# EAGLE design T2313_DemoBoard (EAGLE 6.5.0)
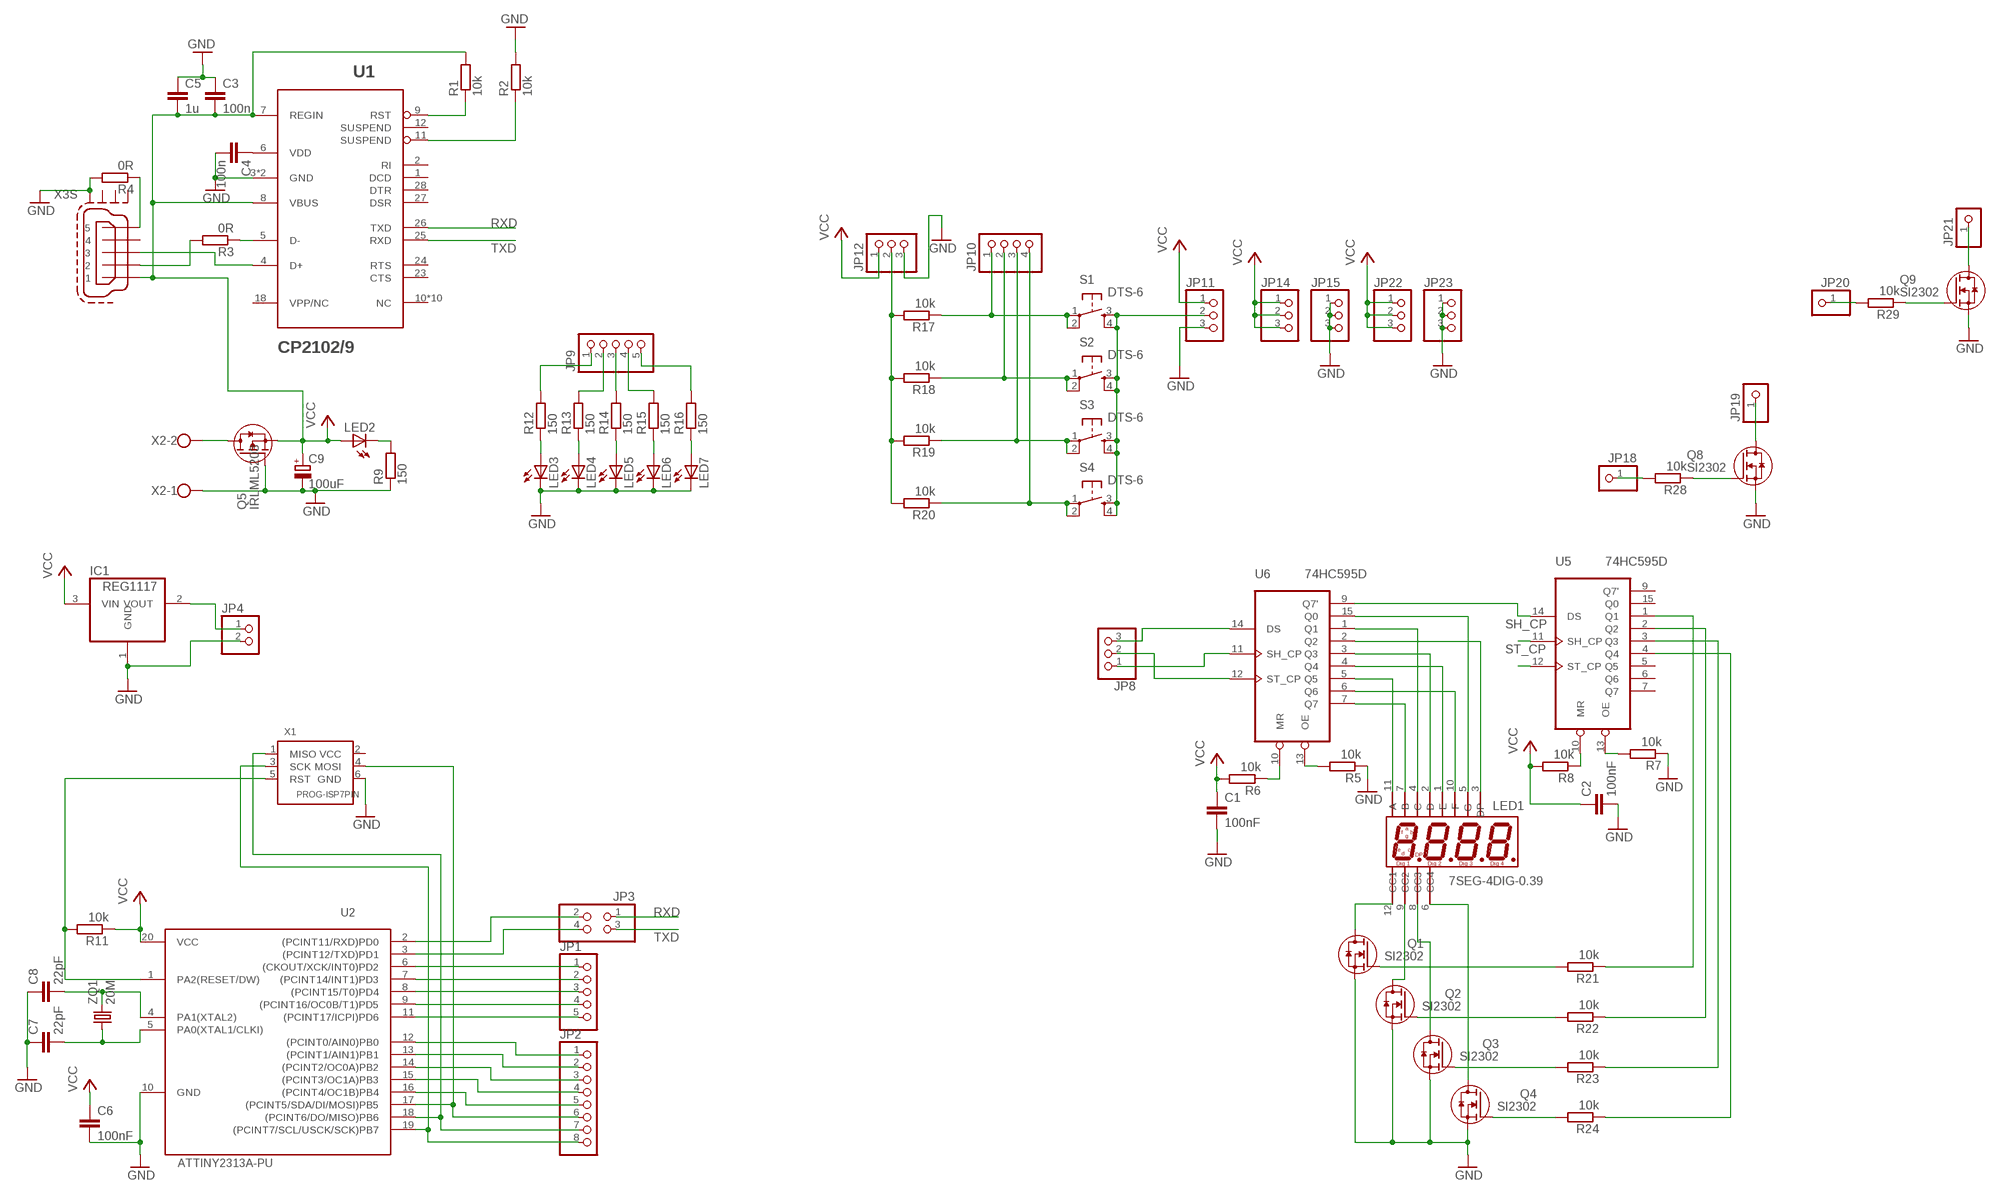
[diagram p0: schematic, sheet 1]

## Parts
C1  100nF  C-EUC0603  [C0603]
C2  100nF  C-EUC0603  [C0603]
C3  100n  C-EUC0603  [C0603]
C4  100n  C-EUC0603  [C0603]
C5  1u  C-EUC0805  [C0805]
C6  100nF  C-EUC0603  [C0603]
C7  22pF  C-EUC0603  [C0603]
C8  22pF  C-EUC0603  [C0603]
C9  100uF  CPOL-EUE2-5  [E2-5]
IC1  REG1117  [SOT223]
JP1  PINHD-1X5  [1X05]
JP2  PINHD-1X8  [1X08]
JP3  PINHD-2X2  [2X02]
JP4  PINHD-1X2  [1X02]
JP8  PINHD-1X3  [1X03]
JP9  PINHD-1X5  [1X05]
JP10  PINHD-1X4  [1X04]
JP11  PINHD-1X3  [1X03]
JP12  PINHD-1X3  [1X03]
JP14  PINHD-1X3  [1X03]
JP15  PINHD-1X3  [1X03]
JP18  PINHD-1X1  [1X01]
JP19  PINHD-1X1  [1X01]
JP20  PINHD-1X1  [1X01]
JP21  PINHD-1X1  [1X01]
JP22  PINHD-1X3  [1X03]
JP23  PINHD-1X3  [1X03]
LED1  7SEG-4DIG-0.39  [7SEG_4DIG_0.39]
LED2  LEDSML0805  [SML0805]
LED3  LEDCHIPLED_0805  [CHIPLED_0805]
LED4  LEDCHIPLED_0805  [CHIPLED_0805]
LED5  LEDCHIPLED_0805  [CHIPLED_0805]
LED6  LEDCHIPLED_0805  [CHIPLED_0805]
LED7  LEDCHIPLED_0805  [CHIPLED_0805]
Q1  SI2302  [SOT-23-GSD]
Q2  SI2302  [SOT-23-GSD]
Q3  SI2302  [SOT-23-GSD]
Q4  SI2302  [SOT-23-GSD]
Q5  IRLML5203  [SOT-23-GSD]
Q8  SI2302  [SOT-23-GSD]
Q9  SI2302  [SOT-23-GSD]
R1  10k  R-EU_R0603  [R0603]
R2  10k  R-EU_R0603  [R0603]
R3  0R  R-EU_R0805  [R0805]
R4  0R  R-EU_R0805  [R0805]
R5  10k  R-EU_R0805  [R0805]
R6  10k  R-EU_R0805  [R0805]
R7  10k  R-EU_R0805  [R0805]
R8  10k  R-EU_R0805  [R0805]
R9  150  R-EU_R0805  [R0805]
R11  10k  R-EU_R0805  [R0805]
R12  150  R-EU_R0805  [R0805]
R13  150  R-EU_R0805  [R0805]
R14  150  R-EU_R0805  [R0805]
R15  150  R-EU_R0805  [R0805]
R16  150  R-EU_R0805  [R0805]
R17  10k  R-EU_R0805  [R0805]
R18  10k  R-EU_R0805  [R0805]
R19  10k  R-EU_R0805  [R0805]
R20  10k  R-EU_R0805  [R0805]
R21  10k  R-EU_R0805  [R0805]
R22  10k  R-EU_R0805  [R0805]
R23  10k  R-EU_R0805  [R0805]
R24  10k  R-EU_R0805  [R0805]
R28  10k  R-EU_R0805  [R0805]
R29  10k  R-EU_R0805  [R0805]
S1  DTS-6  [DTS-6]
S2  DTS-6  [DTS-6]
S3  DTS-6  [DTS-6]
S4  DTS-6  [DTS-6]
U1  CP2102/9  [QFN-28]
U2  ATTINY2313A-PU  [DIL20]
U5  74HC595D  [SO16]
U6  74HC595D  [SO16]
X1  PROG-ISP7PIN  [PROG_PIN]
X2  W237-102  [W237-102]
X3  MINI-USB-SCHIELD-32005-201  [32005-201]
ZQ1  20M  CRYSTALHC49S  [HC49/S]

## Nets
GND: C1.2 C2.2 C3.1 C4.2 C5.1 C6.2 C7.1 C8.1 C9.- IC1.1(GND) JP4.2 JP11.3 JP12.3 JP15.1 JP15.2 JP15.3 JP23.1 JP23.2 JP23.3 LED3.C LED4.C LED5.C LED6.C LED7.C Q1.S Q2.S Q3.S Q4.S Q5.G Q8.S Q9.S R2.2 R4.2 R5.1 R7.1 R9.1 U1.3(GND) U1.P$29(GND) U2.10(GND) X1.6(GND) X2.1 X3.M4(S:S4)
N$1: JP1.5 U2.11((PCINT17/ICPI)PD6)
N$3: JP1.4 U2.9((PCINT16/OC0B/T1)PD5)
N$4: JP1.3 U2.8((PCINT15/T0)PD4)
N$5: JP1.2 U2.7((PCINT14/INT1)PD3)
N$6: JP1.1 U2.6((CKOUT/XCK/INT0)PD2)
N$7: JP3.4 U2.3((PCINT12/TXD)PD1)
N$8: JP3.2 U2.2((PCINT11/RXD)PD0)
N$9: R6.1 U6.10(MR)
N$10: JP2.7 U2.18((PCINT6/DO/MISO)PB6) X1.1(MISO)
N$11: C4.1 U1.6(VDD)
N$12: JP2.5 U2.16((PCINT4/OC1B)PB4)
N$13: JP2.4 U2.15((PCINT3/OC1A)PB3)
N$14: JP2.3 U2.14((PCINT2/OC0A)PB2)
N$15: JP2.2 U2.13((PCINT1/AIN1)PB1)
N$16: JP2.1 U2.12((PCINT0/AIN0)PB0)
N$17: R1.1 U1.9(RST)
N$18: R3.2 X3.2
N$19: U1.4(D+) X3.3
N$20: R5.2 U6.13(OE)
N$21: R2.1 U1.11(SUSPEND)
N$22: R8.1 U5.10(MR)
N$23: R3.1 U1.5(D-)
N$24: IC1.2(VOUT) JP4.1
N$25: R7.2 U5.13(OE)
N$26: R4.1 X3.5
N$27: JP8.3 U6.14(DS)
N$28: LED1.11(A) U6.5(Q5)
N$29: LED1.7(B) U6.7(Q7)
N$30: U5.14(DS) U6.9(Q7')
N$31: LED1.4(C) U6.1(Q1)
N$32: LED1.2(D) U6.3(Q3)
N$33: LED1.1(E) U6.4(Q4)
N$34: LED1.10(F) U6.6(Q6)
N$35: LED1.5(G) U6.15(Q0)
N$36: LED1.3(DP) U6.2(Q2)
N$37: LED1.12(CC1) Q1.D
N$38: LED1.9(CC2) Q2.D
N$39: LED1.8(CC3) Q3.D
N$40: LED1.6(CC4) Q4.D
N$41: R21.1 U5.1(Q1)
N$42: R22.1 U5.2(Q2)
N$43: R23.1 U5.3(Q3)
N$44: R24.1 U5.4(Q4)
N$45: C7.2 U2.5(PA0(XTAL1/CLKI)) ZQ1.1
N$46: C8.2 U2.4(PA1(XTAL2)) ZQ1.2
N$47: R11.2 U2.1(PA2(RESET/DW)) X1.5(RST)
N$48: LED2.C R9.2
N$49: LED3.A R12.1
N$50: LED4.A R13.1
N$51: LED5.A R14.1
N$52: LED6.A R15.1
N$53: LED7.A R16.1
N$54: JP9.1 R12.2
N$55: JP9.3 R14.2
N$56: JP9.4 R15.2
N$57: JP9.2 R13.2
N$58: JP9.5 R16.2
N$59: JP10.2 R18.1 S2.1 S2.2
N$60: JP12.2 R17.2 R18.2 R19.2 R20.2
N$61: JP10.1 R17.1 S1.1 S1.2
N$62: JP11.2 S1.3 S1.4 S2.3 S2.4 S3.3 S3.4 S4.3 S4.4
N$63: JP10.3 R19.1 S3.1 S3.2
N$64: JP10.4 R20.1 S4.1 S4.2
N$65: Q4.G R24.2
N$66: Q3.G R23.2
N$67: Q2.G R22.2
N$68: Q1.G R21.2
N$69: Q5.D X2.2
N$72: JP19.1 Q8.D
N$74: Q8.G R28.1
N$75: JP18.1 R28.2
N$76: JP21.1 Q9.D
N$80: Q9.G R29.1
N$81: JP20.1 R29.2
RXD: JP3.1 U1.26(TXD)
SCL: JP2.8 U2.19((PCINT7/SCL/USCK/SCK)PB7) X1.3(SCK)
SDA: JP2.6 U2.17((PCINT5/SDA/DI/MOSI)PB5) X1.4(MOSI)
SH_CP: JP8.1 U5.11(SH_CP) U6.11(SH_CP)
ST_CP: JP8.2 U5.12(ST_CP) U6.12(ST_CP)
TXD: JP3.3 U1.25(RXD)
VCC: C1.1 C2.1 C3.2 C5.2 C6.1 C9.+ IC1.3(VIN) JP11.1 JP12.1 JP14.1 JP14.2 JP14.3 JP22.1 JP22.2 JP22.3 LED2.A Q5.S R1.2 R6.2 R8.2 R11.1 U1.7(REGIN) U1.8(VBUS) U2.20(VCC) X3.1
Unconnected: U1.1(DCD) U1.2(RI) U1.10(NC) U1.12(SUSPEND) U1.13(NC) U1.14(NC) U1.15(NC) U1.16(NC) U1.17(NC) U1.18(VPP/NC) U1.19(NC) U1.20(NC) U1.21(NC) U1.22(NC) U1.23(CTS) U1.24(RTS) U1.27(DSR) U1.28(DTR) U5.5(Q5) U5.6(Q6) U5.7(Q7) U5.9(Q7') U5.15(Q0) X1.2(VCC) X3.4 X3.M1(S:S1) X3.M2(S:S2) X3.M3(S:S3)

## Power pins joined to a net without a drawn wire
GND: U5.8(GND) U6.8(GND)
VCC: U5.16(VCC) U6.16(VCC)

## Library data of the parts
C1-C8 = rcl:C-EU: CAPACITOR, European symbol
C9 = rcl:CPOL-EU: POLARIZED CAPACITOR, European symbol
IC1 = burr-brown:REG1117: 800mA and 1A Low Dropout (LDO) Positive Regulator 1.8V, 2.5V, 2.85V, 3.3V, 5V, and Adj; MPN: REG1117; OC_FARNELL: 1097566; OC_NEWARK: 14P6981
JP1 JP9 = pinhead:PINHD-1X5: PIN HEADER
JP2 = pinhead:PINHD-1X8: PIN HEADER
JP3 = usb:PINHD-2X2: PIN HEADER
JP4 = pinhead:PINHD-1X2: PIN HEADER
JP8 JP11 JP12 JP14 JP15 JP22 JP23 = pinhead:PINHD-1X3: PIN HEADER
JP10 = pinhead:PINHD-1X4: PIN HEADER
JP18-JP21 = pinhead:PINHD-1X1: PIN HEADER
LED1 = usb:7SEG-4DIG: 7 Segment 4 Digit Common Catode
LED2-LED7 = led:LED: LED OSRAM: - CHIPLED LG R971, LG N971, LY N971, LG Q971, LY Q971, LO R971, LY R971 LH N974, LH R974 LS Q976, LO Q976, LY Q976 LO Q996 - Hyper CHIPLED LW Q18S LB Q993, LB Q99A, LB R99A - SideLED LS A670, LO A670, LY A670, LG A670, LP A670 LB A673, LV A673, LT A673, LW A673 LH A674 LY A675 LS A676, LA A676, LO A676, LY A676, LW A676 LS A679, LY A679, LG A679 - Hyper Micro SIDELED® LS Y876, LA Y876, LO Y876, LY Y876 LT Y87S - SmartLED LW L88C, LW L88S LB L89C, LB L89S, LG L890 LS L89K, LO L89K, LY L89K LS L896, LA L896, LO L896, LY L896 - TOPLED LS T670, LO T670, LY T670, LG T670, LP T670 LSG T670, LSP T670, LSY T670, LOP T670, LYG T670 LG T671, LOG T671, LSG T671 LB T673, LV T673, LT T673, LW T673 LH T674 LS T676, LA T676, LO T676, LY T676, LB T676, LH T676, LSB T676, LW T676 LB T67C, LV T67C, LT T67C, LS T67K, LO T67K, LY T67K, LW E67C LS E67B, LA E67B, LO E67B, LY E67B, LB E67C, LV E67C, LT E67C LW T67C LS T679, LY T679, LG T679 LS T770, LO T770, LY T770, LG T770, LP T770 LB T773, LV T773, LT T773, LW T773 LH T774 LS E675, LA E675, LY E675, LS T675 LS T776, LA T776, LO T776, LY T776, LB T776 LHGB T686 LT T68C, LB T68C - Hyper Mini TOPLED® LB M676 - Mini TOPLED Santana® LG M470 LS M47K, LO M47K, LY M47K Source: http://www.osram.convergy.de LUXEON: - LUMILED® LXK2-PW12-R00, LXK2-PW12-S00, LXK2-PW14-U00, LXK2-PW14-V00 LXK2-PM12-R00, LXK2-PM12-S00, LXK2-PM14-U00 LXK2-PE12-Q00, LXK2-PE12-R00, LXK2-PE12-S00, LXK2-PE14-T00, LXK2-PE14-U00 LXK2-PB12-K00, LXK2-PB12-L00, LXK2-PB12-M00, LXK2-PB14-N00, LXK2-PB14-P00, LXK2-PB14-Q00 LXK2-PR12-L00, LXK2-PR12-M00, LXK2-PR14-Q00, LXK2-PR14-R00 LXK2-PD12-Q00, LXK2-PD12-R00, LXK2-PD12-S00 LXK2-PH12-R00, LXK2-PH12-S00 LXK2-PL12-P00, LXK2-PL12-Q00, LXK2-PL12-R00 Source: www.luxeon.com KINGBRIGHT: KA-3528ASYC Source: www.kingbright.com
Q1-Q4 Q8 Q9 = usb:SI2302: N-канальный полевик
Q5 = usb:IRLML5203
R1-R9 R11-R24 R28 R29 = rcl:R-EU_: RESISTOR, European symbol
S1-S4 = switch-tact:DTS-6
U1 = usb:CP2102/9
U2 = usb:ATTINY2313A
U5 U6 = 74xx-eu:74*595: 8-bit SHIFT REGISTER, output latch
X1 = usb:PROG-ISP
X2 = con-wago-500:W237-102: WAGO SCREW CLAMP; MPN: 237-102; OC_FARNELL: unknown; OC_NEWARK: 70K9898
X3 = con-cypressindustries:MINI-USB-SCHIELD-: MINI USB-B Conector Source: www.cypressindustries.com; OC_FARNELL: unknown; OC_NEWARK: unknown
ZQ1 = crystal:CRYSTAL: CRYSTAL; OC_FARNELL: 1667008; OC_NEWARK: unknown

## Board
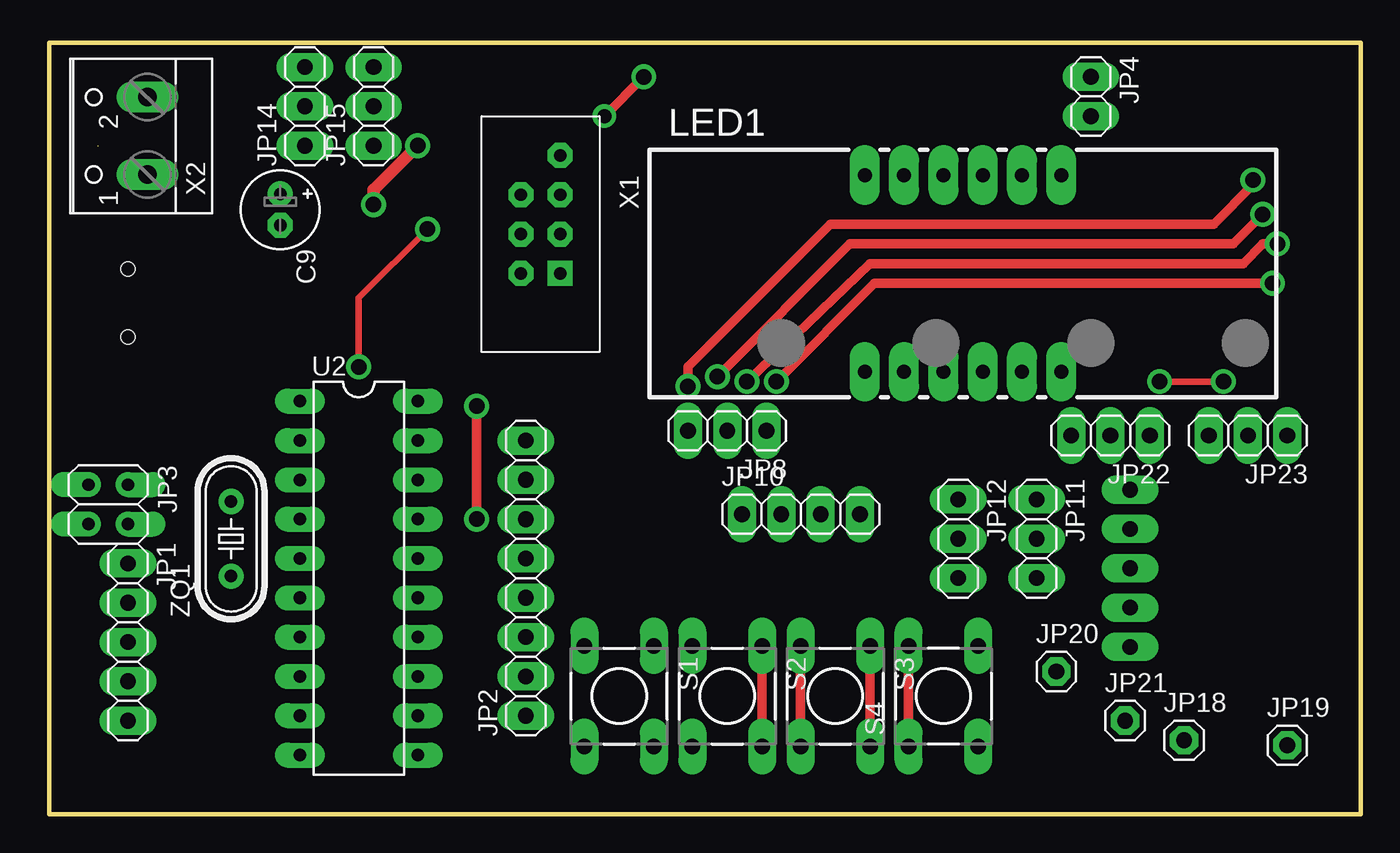
[diagram p1: board, top side]
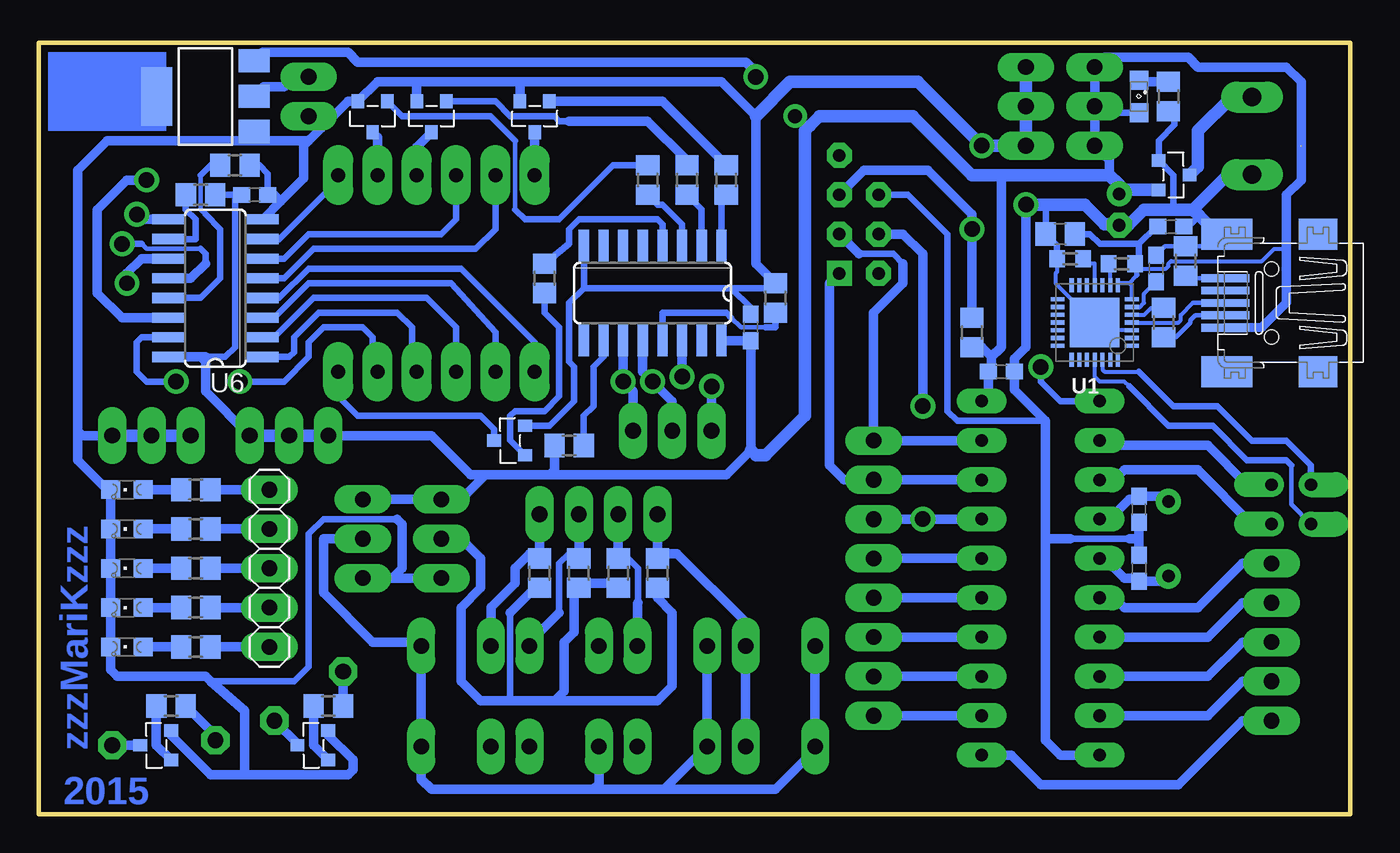
[diagram p2: board, bottom side, seen from below]

Size 84.76 x 49.84 mm. Coordinates in mm from the lower left corner, seen from the top.
Outline: 0,0 84.76,0 84.76,49.84 0,49.84 0,0
Copper layers (1*16): Top 0.035mm / dielectric 1.5mm / Bottom 0.035mm
Design rules "default": minimum track width 12mil, minimum drill 32mil, track to track 12mil, track to pad 12mil, pad to pad 12mil, via to via 12mil, smd to smd 8mil, copper to edge 40mil, drill to drill 8mil, minimum pad ring 16mil, minimum via ring 12mil, stop-mask expansion 4mil, vias tented up to drill 0mil, thermal gap 20mil

### Footprints (pad centres in the part's own frame; a part is rotated, then mirrored left to right if it is on the bottom)
C0603 = smd 1.1 x 1: 1 -0.85,0; 2 0.85,0
C0805 = smd 1.3 x 1.5: 1 -0.95,0; 2 0.95,0
E2-5 = drill 0.813 pad 1.27: + -1.016,0 | drill 0.813 pad 1.27 octagon: - 1.016,0
SOT223 = smd 1.499 x 2.007: 1 -2.261,-3.15; 2 0.025,-3.15; 3 2.311,-3.15 | smd 3.81 x 2.007: 4 0,3.15
1X05 = drill 1.016 long: 1 -5.08,0; 2 -2.54,0; 3 0,0; 4 2.54,0; 5 5.08,0
1X08 = drill 1.016 long: 1 -8.89,0; 2 -6.35,0; 3 -3.81,0; 4 -1.27,0; 5 1.27,0; 6 3.81,0; 7 6.35,0; 8 8.89,0
2X02 = drill 0.8 offset: 1 -1.27,-1.27; 2 -1.27,1.27; 3 1.27,-1.27; 4 1.27,1.27
1X02 = drill 1.016 long: 1 -1.27,0; 2 1.27,0
1X03 = drill 1.016 long: 1 -2.54,0; 2 0,0; 3 2.54,0
1X04 = drill 1.016 long: 1 -3.81,0; 2 -1.27,0; 3 1.27,0; 4 3.81,0
1X01 = drill 1.016 octagon: 1 0,0
7SEG_4DIG_0.39 = drill 0.9 pad 1.93 long: 1 0,0; 2 2.54,0; 3 5.08,0; 4 7.62,0; 5 10.16,0; 6 12.7,0; 7 12.7,12.7; 8 10.16,12.7; 9 7.62,12.7; 10 5.08,12.7; 11 2.54,12.7; 12 0,12.7
SML0805 = smd 1.2 x 1.2: A 1.05,0; C -1.05,0
CHIPLED_0805 = smd 1.2 x 1.2: A 0,-1.05; C 0,1.05
SOT-23-GSD = smd 0.8 x 0.9: D 0,2; G -0.95,0; S 0.95,0
R0603 = smd 1 x 1.1: 1 -0.85,0; 2 0.85,0
R0805 = smd 1.3 x 1.5: 1 -0.95,0; 2 0.95,0
DTS-6 = drill 1 long: 1 -3.25,2.25; 2 3.25,2.25; 3 -3.25,-2.25; 4 3.25,-2.25
QFN-28 = smd 0.9 x 0.27: 1 -2.4,1.5; 2 -2.4,1; 3 -2.4,0.5; 4 -2.4,0; 5 -2.4,-0.5; 6 -2.4,-1; 7 -2.4,-1.5; 15 2.4,-1.5; 16 2.4,-1; 17 2.4,-0.5; 18 2.4,0; 19 2.4,0.5; 20 2.4,1; 21 2.4,1.5 | smd 0.27 x 0.9: 8 -1.5,-2.4; 9 -1,-2.4; 10 -0.5,-2.4; 11 0,-2.4; 12 0.5,-2.4; 13 1,-2.4; 14 1.5,-2.4; 22 1.5,2.4; 23 1,2.4; 24 0.5,2.4; 25 0,2.4; 26 -0.5,2.4; 27 -1,2.4; 28 -1.5,2.4 | smd 3.2 x 3.2: P$29 0,0
DIL20 = drill 0.813 long: 1 -11.43,-3.81; 2 -8.89,-3.81; 3 -6.35,-3.81; 4 -3.81,-3.81; 5 -1.27,-3.81; 6 1.27,-3.81; 7 3.81,-3.81; 8 6.35,-3.81; 9 8.89,-3.81; 10 11.43,-3.81; 11 11.43,3.81; 12 8.89,3.81; 13 6.35,3.81; 14 3.81,3.81; 15 1.27,3.81; 16 -1.27,3.81; 17 -3.81,3.81; 18 -6.35,3.81; 19 -8.89,3.81; 20 -11.43,3.81
SO16 = smd 0.66 x 2.032: 1 -4.445,-3.073; 2 -3.175,-3.073; 3 -1.905,-3.073; 4 -0.635,-3.073; 5 0.635,-3.073; 6 1.905,-3.073; 7 3.175,-3.073; 8 4.445,-3.073; 9 4.445,3.073; 10 3.175,3.073; 11 1.905,3.073; 12 0.635,3.073; 13 -0.635,3.073; 14 -1.905,3.073; 15 -3.175,3.073; 16 -4.445,3.073
PROG_PIN = drill 0.8 square: 1 0,7.62 | drill 0.8 octagon: 2 2.54,7.62; 3 0,5.08; 4 2.54,5.08; 5 0,2.54; 6 2.54,2.54; KEY 0,0
W237-102 = drill 1.194 long: 1 -2.5,-1.27; 2 2.5,-1.27
32005-201 = smd 3.1 x 0.5: 1 3,1.6; 2 3,0.8; 3 3,0; 4 3,-0.8; 5 3,-1.6 | smd 2.5 x 2: M1 -3,-4.45; M2 -3,4.45 | smd 3.3 x 2: M3 2.9,4.45; M4 2.9,-4.45 | hole 0.9: 0,2.2; 0,-2.2
HC49/S = drill 0.813: 1 -2.413,0; 2 2.413,0

### Placement (x,y rotation side)
C1  38.73,31.43 90 bottom
C2  70.8,40.01 0 bottom
C3  11.59,37.94 180 bottom
C4  12.54,35.24 90 bottom
C5  18.73,37.47 0 bottom
C6  22.54,28.57 0 bottom
C7  13.65,15.88 270 bottom
C8  13.65,19.68 90 bottom
C9  14.92,39.05 270 top
IC1  73.98,46.35 90 bottom
JP1  5.08,11.11 270 top
JP2  30.8,15.24 90 top
JP3  3.81,20 270 top
JP4  67.31,46.35 270 top
JP8  43.81,24.77 180 top
JP9  69.85,15.88 90 bottom
JP10  48.58,19.37 0 top
JP11  63.82,17.78 270 top
JP12  58.74,17.78 270 top
JP14  16.51,45.72 90 top
JP15  20.95,45.72 90 top
JP18  73.34,4.76 0 top
JP19  80.01,4.45 0 top
JP20  65.09,9.21 0 top
JP21  69.53,6.03 0 top
JP22  68.58,24.45 180 top
JP23  77.47,24.45 180 top
LED1  52.7,28.57 0 top
LED2  13.65,46.35 270 bottom
LED3  79.06,10.79 90 bottom
LED4  79.06,13.34 90 bottom
LED5  79.06,15.88 90 bottom
LED6  79.06,18.41 90 bottom
LED7  79.06,20.95 90 bottom
Q1  52.7,46.04 180 bottom
Q2  59.37,46.04 180 bottom
Q3  63.18,46.04 180 bottom
Q4  53.34,24.13 90 bottom
Q5  12.38,41.27 270 bottom
Q8  76.2,4.45 90 bottom
Q9  66.04,4.45 90 bottom
R1  14.76,35.56 0 bottom
R2  18.1,35.88 180 bottom
R3  12.06,31.75 270 bottom
R4  10.64,35.72 90 bottom
R5  72.07,41.91 180 bottom
R6  74.3,40.01 0 bottom
R7  37.15,33.34 270 bottom
R8  50.48,23.81 180 bottom
R9  11.75,46.35 90 bottom
R11  24.45,31.11 90 bottom
R12  74.61,10.79 0 bottom
R13  74.61,13.34 0 bottom
R14  74.61,15.88 0 bottom
R15  74.61,18.41 0 bottom
R16  74.61,20.95 0 bottom
R17  44.77,15.56 270 bottom
R18  47.31,15.56 270 bottom
R19  49.85,15.56 270 bottom
R20  52.39,15.56 270 bottom
R21  40.32,40.96 90 bottom
R22  42.86,40.96 90 bottom
R23  45.4,40.96 90 bottom
R24  52.07,34.61 270 bottom
R28  76.2,6.99 0 bottom
R29  66.04,6.99 0 bottom
S1  36.83,7.62 270 top
S2  43.81,7.62 270 top
S3  50.8,7.62 270 top
S4  57.78,7.62 90 top
U1  16.51,31.75 180 bottom
U2  20,15.24 270 top
U5  45.09,33.66 180 bottom
U6  73.34,33.97 90 bottom
X1  33.02,42.55 180 top
X2  5.08,43.81 90 top
X3  5.08,33.02 180 bottom
ZQ1  11.75,17.78 90 top

### Tracks (layer width: path | path; a pad name or v marks a point on that pad's centre or on a via)
GND  (via drill 1)
  Top 0.813: v20.95,39.37 20.95,40.32 v23.81,43.18
  Bottom 0.254: U1.3 16.01,31.25 U1.P$29 19.05,34.29 19.05,34.92 18.95,35.03 R2.2
  Bottom 0.305: C4.2 11.96,36.67 R4.2 9.53,36.67 8.73,37.47
  Bottom 0.406: 14.29,17.78 18.1,17.78 | U5.8 49.53,33.97 | 49.53,33.97 50.48,33.02 50.48,29.21 50.16,28.89 50.16,26.67 51.75,25.08 Q4.S | C1.2 38.73,32.7 40.01,33.97 | 40.01,33.97 49.53,33.97 | R5.1 70.48,41.91 69.95,41.38 C2.2 | R7.1 36.83,33.97 40.01,33.97 | X1.6 28.57,40.01 26.04,37.47 26.04,26.04 25.4,25.4 19.68,25.4 | 61.59,19.05 66.36,19.05 67.31,18.1 67.31,9.53 68.26,8.57 73.66,8.57 | 11.36,45.41 11.36,44.52 12.38,43.5 Q5.G 11.43,41.27 11.43,39.37 11.11,39.05 | C3.1 10.48,37.94 9.76,38.66 | R2.2 18.95,36.73 C5.1 19.68,39.21 19.53,39.37
  Bottom 0.61: C8.1 13.65,17.78 | 13.65,17.78 14.29,17.78 | 19.68,17.78 19.68,25.4 21.69,27.41 C6.2 21.69,29.43 20.95,30.16 v20.95,39.37 | 19.68,17.78 19.68,4.76 18.73,3.81 U2.10 | R7.1 38.42,35.56 38.42,45.09 40.64,47.31 53.66,47.31 | Q1.S 53.66,47.31 | 60.33,47.31 62.86,47.31 Q3.S 64.77,46.04 66.52,44.29 | 60.33,47.31 53.66,47.31 | Q2.S 60.33,47.31 | C7.1 13.65,17.78 | JP12.3 JP11.3 61.91,15.24 61.28,15.88 61.28,18.73 61.59,19.05 | Q9.S 66.04,5.08 64.45,3.49 64.45,2.86 64.77,2.54 71.44,2.54 | Q8.S 76.2,5.08 73.66,2.54 71.44,2.54 | 66.52,44.29 67.31,43.5 | 67.31,43.5 67.63,43.18 67.63,41.06 69.11,39.58 | 69.11,39.58 U6.8 | C2.2 69.64,40.11 69.11,39.58 | 82.23,24.77 82.23,41.59 80.33,43.5 70.48,43.5 | JP23.1 81.92,24.45 82.23,24.77 | 71.44,2.54 71.44,6.67 73.66,8.57 73.98,8.89 79.69,8.89 80.11,9.3 LED3.C LED4.C LED5.C LED6.C LED7.C 80.33,20.95 82.23,22.86 82.23,24.77 | R9.1 11.36,45.41 | 18.1,17.78 19.68,17.78 | X3.M4 8.73,37.47 9.21,37.47 | 70.48,43.5 67.31,43.5 | 67.31,43.5 67.33,43.52 | IC1.1 70.48,43.75 70.48,43.5 | JP4.2 66.52,44.29
  Bottom 0.813: JP23.1 JP23.2 JP23.3 | 38.42,45.09 36.2,47.31 27.94,47.31 v23.81,43.18 JP15.1 JP15.2 JP15.3 | R9.1 | X2.1 7.9,41.31 10.16,39.05 | v20.95,39.37 19.53,39.37 17.14,39.37 15.88,38.1 14.99,38.1 C9.- 14.35,38.04 13.34,39.05 11.11,39.05 10.16,39.05 | 9.21,37.47 9.21,38.1 9.76,38.66 10.16,39.05
N$1
  Bottom 0.61: U2.11 21.91,3.81 20,1.91 11.11,1.91 6.99,6.03 JP1.5
N$3
  Bottom 0.61: U2.9 9.21,6.35 6.99,8.57 JP1.4
N$4
  Bottom 0.61: U2.8 9.21,8.89 6.99,11.11 JP1.3
N$5
  Bottom 0.61: U2.7 9.21,11.43 6.99,13.65 JP1.2
N$6
  Bottom 0.61: U2.6 15.24,13.97 14.61,13.34 9.84,13.34 6.99,16.19 JP1.1
N$7
  Bottom 0.61: U2.3 15.24,21.59 14.61,22.23 9.84,22.23 6.35,18.73 JP3.4
N$8
  Bottom 0.61: U2.2 15.24,24.13 14.92,23.81 9.21,23.81 6.67,21.27 JP3.2
N$9
  Bottom 0.406: R6.1 75.25,39.05 74.61,38.42 74.61,37.15 U6.10
N$10
  Bottom 0.61: U2.18 JP2.7 32.7,21.59 33.66,22.54 33.66,34.29 X1.1
N$11
  Bottom 0.254: U1.6 13.61,32.75 13.34,33.02 13.34,33.6 C4.1
N$12
  Bottom 0.61: U2.16 JP2.5
N$13
  Bottom 0.61: U2.15 JP2.4
N$14
  Bottom 0.61: U2.14 JP2.3
N$15
  Bottom 0.61: U2.13 JP2.2
N$16
  Bottom 0.61: U2.12 JP2.1
N$17
  Bottom 0.254: U1.9 15.51,35.82 R1.1
N$18
  Bottom 0.305: X3.2 10.01,32.22 10.32,31.91 10.32,31.75 11.27,30.8 R3.2
N$19
  Bottom 0.254: U1.4 11.11,31.75 10.95,31.91 10.95,32.23 10.16,33.02
  Bottom 0.305: X3.3 10.16,33.02
N$20
  Bottom 0.305: 74.3,41.27 74.3,39.05 73.98,38.73
  Bottom 0.406: R5.2 73.66,41.91 74.3,41.27 | 73.98,38.73 73.03,37.78 73.03,34.61 74.3,33.34 U6.13
N$21
  Bottom 0.254: U1.11 16.51,35.56 16.93,35.56 R2.1
N$22
  Bottom 0.406: R8.1 49.53,25.71 48.9,26.35 48.9,28.89 48.26,29.53 U5.10
N$23
  Bottom 0.254: U1.5 13.31,32.25 12.86,32.7 R3.1
N$24
  Bottom 0.61: IC1.2 70.22,46.99 68.9,46.99 68.26,47.62 JP4.1
N$25
  Bottom 0.305: 37.78,31.43 39.37,31.43 40.01,32.07
  Bottom 0.406: R7.2 37.15,31.43 37.78,31.43 | 40.01,32.07 40.32,32.38 44.45,32.38 U5.13
N$26
  Bottom 0.305: X3.5 10.49,34.62 R4.1
N$27  (via drill 1)
  Top 0.61: v77.79,40.96 77.79,40.64 75.25,38.1 50.48,38.1 41.27,28.89 v41.27,27.62
  Bottom 0.61: U6.14 79.38,32.07 80.96,33.66 80.96,39.05 79.06,40.96 v77.79,40.96 | v41.27,27.62 JP8.3
N$28
  Bottom 0.406: U6.5 68.9,34.61 66.99,36.51 56.52,36.51 55.24,37.78 LED1.11
N$29
  Bottom 0.406: U6.7 69.22,37.15 65.41,40.96 LED1.7
N$30  (via drill 1)
  Top 0.61: v78.42,38.73 76.52,36.83 51.75,36.83 v43.18,28.26
  Bottom 0.61: U6.9 78.11,38.42 v78.42,38.73 | v43.18,28.26 U5.14
N$31
  Bottom 0.406: U6.1 68.58,29.53 68.26,29.84 68.26,30.8 66.67,32.38 61.59,32.38 60.64,31.43 60.64,28.89 LED1.4
N$32
  Bottom 0.406: U6.3 69.53,32.07 67.31,34.29 58.1,34.29 55.24,31.11 LED1.2
N$33
  Bottom 0.406: U6.4 69.22,33.34 67.31,35.24 57.47,35.24 52.7,30.48 LED1.1
N$34
  Bottom 0.406: U6.6 68.9,35.88 67.31,37.47 58.74,37.47 57.78,38.42 LED1.10
N$35  (via drill 1)
  Top 0.406: v71.75,27.94 v75.88,27.94
  Bottom 0.406: U6.15 78.11,30.8 78.42,30.48 78.42,28.57 77.79,27.94 v75.88,27.94 | v71.75,27.94 68.9,27.94 67.31,29.53 67.31,30.48 66.36,31.43 63.82,31.43 63.18,30.8 63.18,28.89 LED1.5
N$36
  Bottom 0.406: U6.2 69.53,30.8 66.99,33.34 59.69,33.34 57.78,31.43 LED1.3
N$37
  Bottom 0.61: LED1.12 Q1.D
N$38
  Bottom 0.61: LED1.9 60.33,43.09 Q2.D
N$39
  Bottom 0.61: LED1.8 62.87,43.72 Q3.D
N$40
  Bottom 0.406: Q4.D 55.34,24.86 56.2,25.72 64.14,25.72 65.41,26.99 LED1.6
N$41
  Bottom 0.406: U5.1 40.64,39.69 R21.1
N$42
  Bottom 0.406: U5.2 41.91,39.05 R22.1
N$43
  Bottom 0.406: U5.3 43.18,38.1 44.45,39.37 44.77,39.37 R23.1
N$44
  Bottom 0.406: U5.4 44.45,38.1 44.77,38.42 49.85,38.42 50.48,37.78 50.48,36.83 R24.1
N$45
  Bottom 0.61: U2.5 15.88,16.51 14.61,15.24 13.87,15.24 C7.2 12.09,15.03 ZQ1.1
N$46
  Bottom 0.61: U2.4 15.56,19.05 14.29,20.32 13.87,20.32 C8.2 12.09,20.54 ZQ1.2
N$47  (via drill 1)
  Top 0.406: v20,28.89 20,33.34 v24.45,37.78
  Bottom 0.406: U2.1 18.73,26.67 20,27.94 v20,28.89
  Bottom 0.61: X1.5 31.43,41.59 27.3,41.59 24.45,38.73 v24.45,37.78 R11.2
N$48
  Bottom 0.61: R9.2 13.55,47.3 LED2.C
N$49
  Bottom 0.61: R12.1 LED3.A
N$50
  Bottom 0.61: R13.1 LED4.A
N$51
  Bottom 0.61: R14.1 LED5.A
N$52
  Bottom 0.61: R15.1 LED6.A
N$53
  Bottom 0.61: R16.1 LED7.A
N$54
  Bottom 0.61: JP9.1 R12.2
N$55
  Bottom 0.61: JP9.3 R14.2
N$56
  Bottom 0.61: JP9.4 R15.2
N$57
  Bottom 0.61: JP9.2 R13.2
N$58
  Bottom 0.61: JP9.5 R16.2
N$59
  Top 0.61: S2.2 S2.1
  Bottom 0.406: 46.04,13.65 46.04,15.88 46.67,16.51 46.99,16.51 R18.1
  Bottom 0.61: R18.1 JP10.2 | S2.1 46.06,13.62 46.04,13.65
N$60
  Bottom 0.406: 54.29,13.02 54.29,7.62 54.61,7.3
  Bottom 0.61: 52.71,14.61 R20.2 52.39,14.92 54.29,13.02 | R18.2 47.31,14.92 49.84,14.92 R19.2 50.16,14.61 50.16,11.75 50.8,11.11 50.8,7.94 51.44,7.3 | 51.44,7.3 54.61,7.3 56.2,7.3 57.47,8.57 57.47,13.34 56.2,14.61 56.2,16.51 57.47,17.78 JP12.2 | R17.2 44.77,13.97 43.81,13.02 43.81,8.26 44.77,7.3 51.44,7.3
N$61
  Bottom 0.61: JP10.1 R17.1 44.77,16.83 43.5,16.83 39.08,12.41 S1.1 S1.2
N$62
  Top 0.61: S3.3 S3.4
  Bottom 0.61: S2.3 S2.4 44.35,1.59 | 48.9,1.59 59.37,1.59 60.03,2.25 S4.3 S4.4 60.28,11.11 63.18,11.11 66.36,14.29 66.36,17.78 JP11.2 | 48.9,1.59 44.35,1.59 | 44.35,1.59 37.15,1.59 34.58,4.16 S1.4 S1.3 | S3.4 48.55,1.93 48.9,1.59
N$63
  Top 0.61: S3.2 S3.1
  Bottom 0.406: 51.12,13.02 51.12,16.19 50.48,16.83 49.85,16.83 R19.1
  Bottom 0.61: R19.1 JP10.3 | S3.1 53.05,11.09 51.12,13.02
N$64
  Top 0.61: S4.2 S4.1
  Bottom 0.61: JP10.4 R20.1 52.39,16.83 53.02,16.83 53.98,15.88 53.98,14.92 55.53,13.36 S4.2
N$65
  Bottom 0.406: R24.2 52.07,32.38 51.12,31.43 51.12,26.99 52.07,26.04 53.98,26.04 54.29,25.72 54.29,24.13 Q4.G
N$66
  Bottom 0.305: 53.98,39.05 53.98,43.5
  Bottom 0.406: R23.2 47.63,41.91 51.12,38.42 53.34,38.42 53.98,39.05 | 53.98,43.5 55.56,45.09 61.28,45.09 Q3.G
N$67
  Bottom 0.406: 50.48,44.77 51.12,44.77 51.44,45.09 54.29,45.09 55.24,46.04 Q2.G
  Bottom 0.61: R22.2 42.86,42.23 45.4,44.77 50.48,44.77
N$68
  Bottom 0.61: Q1.G 44.45,46.04 R21.2
N$69
  Bottom 0.813: X2.2 7.66,46.31 9.84,44.13 9.84,41.81 Q5.D
N$72
  Bottom 0.61: Q8.D JP19.1
N$74
  Bottom 0.61: R28.1 77.15,4.45 Q8.G
N$75
  Bottom 0.61: JP18.1 73.34,5.08 R28.2
N$76
  Bottom 0.61: Q9.D 68.04,4.54 JP21.1
N$80
  Bottom 0.61: R29.1 66.99,4.45 Q9.G
N$81
  Bottom 0.61: JP20.1 R29.2
RXD
  Bottom 0.254: U1.26 16.01,28.71 15.88,28.57 13.65,28.57
  Bottom 0.406: JP3.1 2.54,22.54 4.13,24.13 6.35,24.13 8.57,26.35 11.43,26.35 13.65,28.57
SCL
  Bottom 0.406: 31.75,36.2 29.53,36.2 28.89,35.56
  Bottom 0.61: U2.19 JP2.8 30.8,32.38 28.89,34.29 28.89,35.56 | X1.3 31.75,36.2
SDA  (via drill 1)
  Top 0.61: v27.62,26.35 v27.62,19.05
  Bottom 0.61: U2.17 v27.62,19.05 JP2.6 31.75,19.05 | X1.4 28.89,37.47 27.62,36.2 v27.62,26.35
SH_CP  (via drill 1)
  Top 0.61: v46.99,27.94 53.34,34.29 v79.06,34.29
  Bottom 0.61: JP8.1 46.35,27.3 v46.99,27.94 U5.11 | U6.11 78.11,35.88 79.06,34.92 v79.06,34.29
ST_CP  (via drill 1)
  Top 0.61: v79.38,36.83 78.42,36.83 77.15,35.56 53.02,35.56 v45.09,27.94
  Bottom 0.305: 74.3,36.51 77.79,36.51 78.11,36.83
  Bottom 0.406: 73.98,35.56 73.98,36.2 74.3,36.51 | 78.11,36.83 v79.38,36.83
  Bottom 0.61: JP8.2 43.81,26.67 v45.09,27.94 45.72,28.57 U5.12 | U6.12 74.93,34.61 73.98,35.56
TXD
  Bottom 0.254: 14.29,27.62 14.61,27.94 16.19,27.94 16.51,28.26 U1.25
  Bottom 0.305: JP3.3 3.81,20 3.81,22.54
  Bottom 0.406: 3.81,22.54 4.13,22.86 6.67,22.86 8.89,25.08 11.75,25.08 14.29,27.62
VCC  (via drill 0.9, 1)  (1 unrouted)
  Top 0.61: v38.42,47.62 v35.88,45.09
  Bottom 0.254: 14.29,34.29 14.87,34.29 U1.8 | R1.2 13.76,34.82 13.81,34.77 | U1.7 14.11,34.11 14.29,34.29 | 14.29,34.29 13.81,34.77 | 13.81,34.77 13.81,35.08 13.65,35.24 11.91,35.24 11.75,35.4 11.75,35.56 11.59,35.72 5.71,35.72 4.92,36.51 4.29,36.51 4.13,36.67
  Bottom 0.305: 8.09,31.43 X3.1
  Bottom 0.406: 73.98,29.53 72.71,29.53 72.07,30.16 72.07,39.69 C2.1 R6.2 | U5.16 C1.1 | LED2.A 16.09,45.3 JP14.2 | C3.2 12.54,37.94 13.65,36.83 | 13.65,36.83 13.65,35.98 R1.2 | C5.2 16.83,37.47 16.19,36.83 13.65,36.83
  Bottom 0.61: 73.98,29.53 74.3,29.53 | 74.3,29.53 U6.16 | JP11.1 JP12.1 | JP12.1 58.42,20.32 | U5.16 38.84,30.58 38.73,30.48 | C1.1 38.73,23.5 40.32,21.91 51.75,21.91 | 51.75,21.91 55.88,21.91 | 74.3,29.53 73.98,29.21 73.98,27.3 JP22.1 | R8.2 51.43,22.23 51.75,21.91 | JP12.1 57.47,20.32 55.88,21.91 | 55.88,21.91 56.83,21.91 59.37,24.45 JP22.3 | 22.54,41.27 22.54,30.16 23.18,29.53 | 15.56,41.27 15.56,42.23 JP14.1 JP14.2 JP14.3 15.88,48.9 10.48,48.9 9.84,48.26 4.13,48.26 3.17,47.31 3.17,43.18 | 23.18,29.53 23.18,28.68 C6.1 23.39,27.09 U2.20 | 23.18,29.53 23.81,30.16 R11.1 | IC1.3 70.28,49.21 64.77,49.21 64.14,48.58 39.05,48.58 38.42,47.94 v38.42,47.62 | v35.88,45.09 35.24,44.45 34.92,44.45 | X3.1 6.68,31.42 5.71,31.43 4.13,33.02 4.13,36.67 4.13,40.01 3.17,40.96 3.17,43.14
  Bottom 0.813: JP22.1 JP22.2 JP22.3 | 38.73,23.5 38.42,23.18 37.78,23.18 35.24,25.72 35.24,44.13 34.92,44.45 34.29,45.09 28.26,45.09 24.45,41.27 22.54,41.27 15.56,41.27 14.92,40.64 C9.+ 14.86,40.07 14.61,40.32 13.02,40.32 13.02,40.33 Q5.S
(copper drawn outside any net)
  shapes: Bottom area x1

### Text on the board
Bottom: zzzMariKzzz | 2015